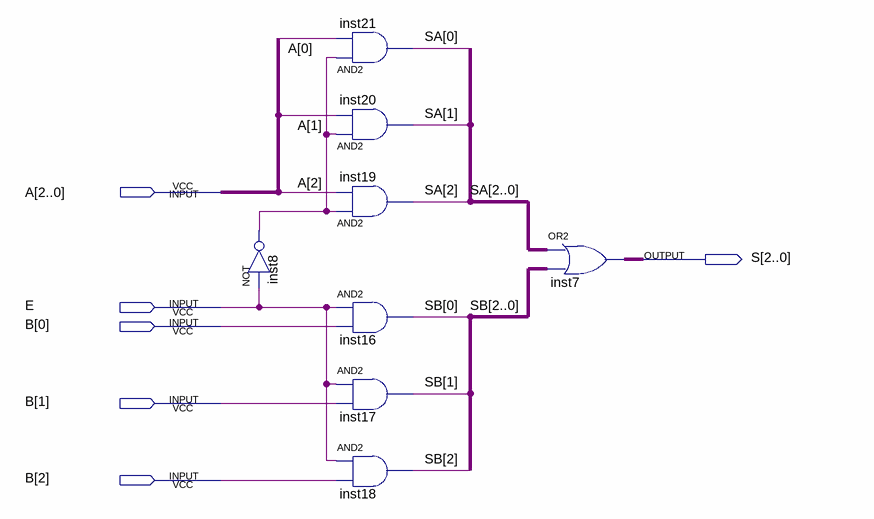
[diagram p0: schematic sheet]
// Quartus schematic Multi_2_1.bdf as structural Verilog: 8 symbols, 6 pins
module Multi_2_1 (
  input  [2:0] A,
  input  E,
  input  [2:0] B,
  output [2:0] S
);

  wire inst8_out;
  wire [2:0] SA, SB;

  not inst8 (inst8_out, E);
  and inst21 (SA[0], inst8_out, A[0]);
  and inst20 (SA[1], inst8_out, A[1]);
  and inst19 (SA[2], inst8_out, A[2]);
  and inst16 (SB[0], E, B[0]);
  and inst17 (SB[1], E, B[1]);
  and inst18 (SB[2], E, B[2]);
  assign S = SA | SB;  // OR2 inst7, 3 bits wide
endmodule
